# Altium schematic sheet Connector_Sheet.SchDoc
size 420 x 297 mm; SheetNumber: 3; SheetTotal: 3
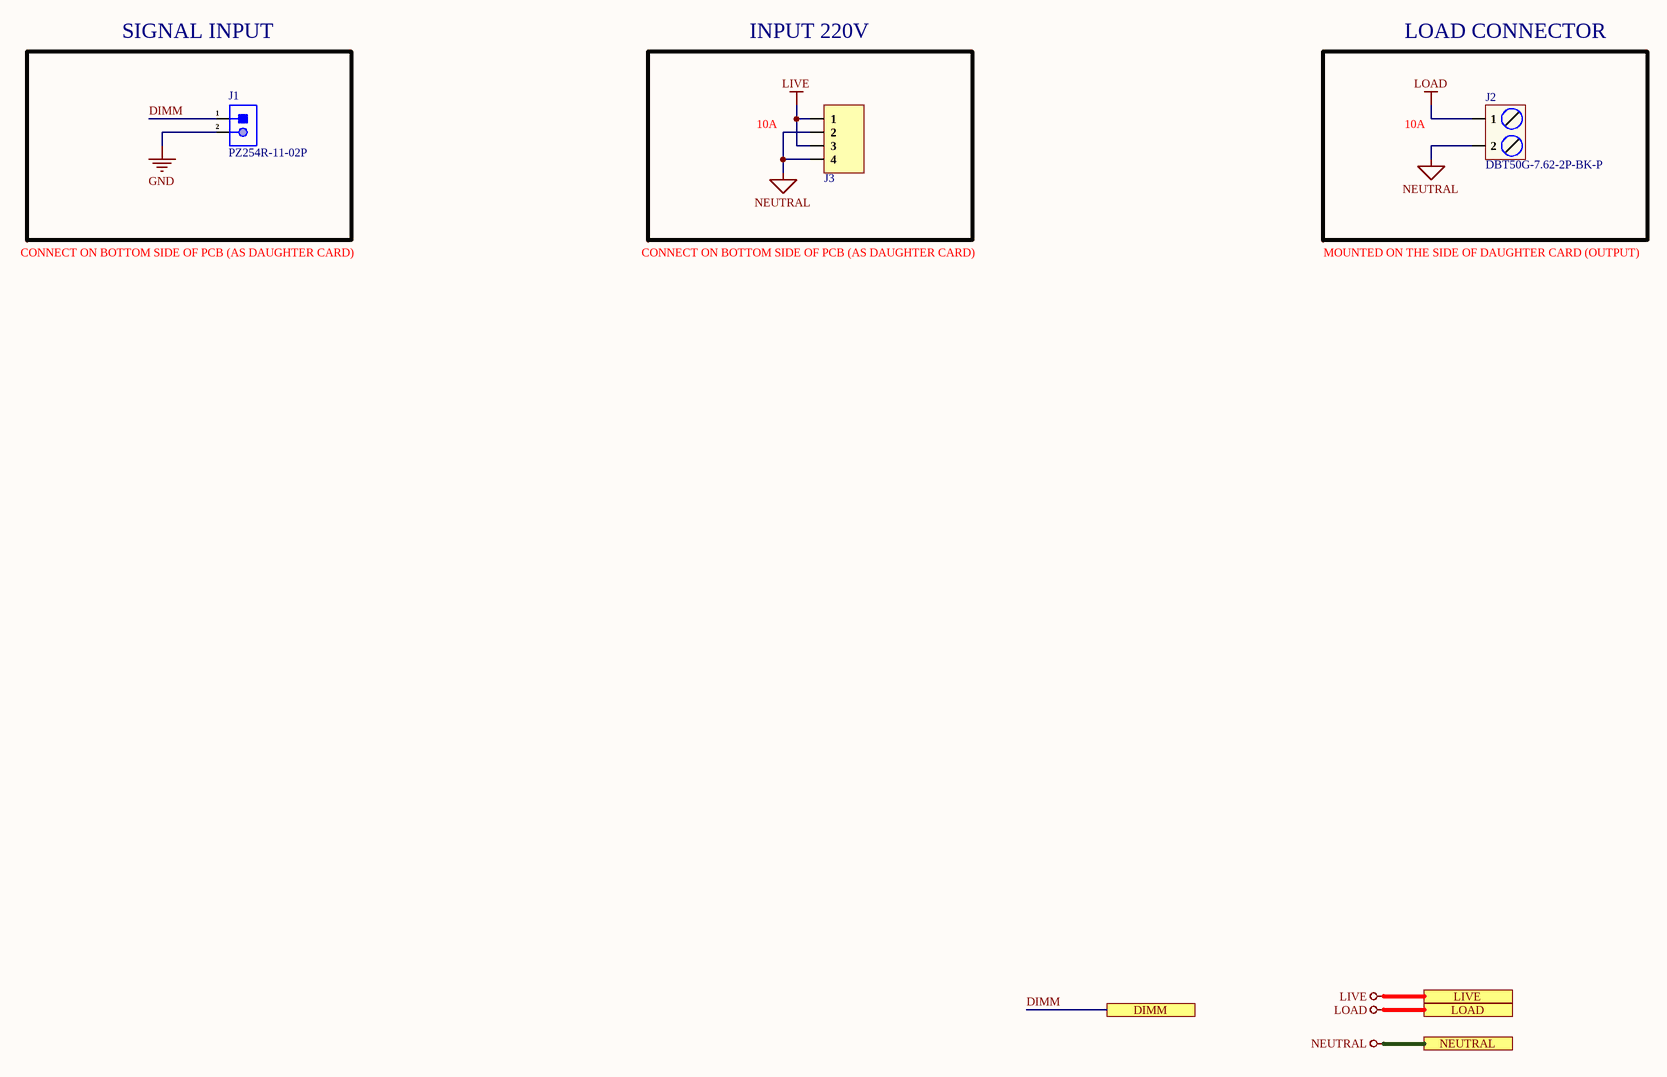
[diagram p0: Connector_Sheet.SchDoc]

## Parts
J1  PZ254R-11-02P  [HDR1X2 (R/A Male)]
J2  DBT50G-7.62-2P-BK-P  [DBT50G-7.62-2P-BK-P]
J3  0444280401  (value not drawn)

## Blocks framed on the sheet
SIGNAL INPUT: J1
INPUT 220V: J3
LOAD CONNECTOR: J2

## Ports
DIMM (see Top_Sheet[3B], Opto_Sheet[4D]), LIVE (see Top_Sheet[2A], Opto_Sheet[5D]), LOAD (see Top_Sheet[3B], Opto_Sheet[5D]), NEUTRAL (see Top_Sheet[2B])

## Nets
GND: J1.2
LIVE: J3.1 J3.3 ; port LIVE
LOAD: J2.1 ; port LOAD
NEUTRAL: J2.2 J3.2 J3.4 ; port NEUTRAL
DIMM: J1.1 ; port DIMM

## Notes on the sheet
- (near J3) 10A
- 10A
- CONNECT ON BOTTOM SIDE OF PCB (AS DAUGHTER CARD)
- MOUNTED ON THE SIDE OF DAUGHTER CARD (OUTPUT)
- File:
- Title:
- Date:
- Page
- Num:
- Total:
- Drawn By: Huzaifa Ali

## Library data of the parts
J1 = PZ254R-11-02P: Right-Angle Square Pins 2.5mm 2P 6mm -40℃~+105℃ 2.54mm Plugin Black Brass 1x2P Push-Pull,P=2.54mm Pin Headers ROHS; Manufacturer: XFCN; Item Type: R/A Male Header; Manufacturer Part Number: PZ254R-11-02P; Package: Push-Pull,P=2.54mm; LCSC Part Number: C492410; ComponentLink1Description: LCSC; ComponentLink1URL: https://www.lcsc.com/product-detail/Pin-Headers_XFCN-PZ254R-11-02P_C492410.html
J2 = DBT50G-7.62-2P-BK-P: 1x2P Corner With Cover Plate 2 1 7.62mm -40℃~+105℃ 20A 300V Black 12~22 Straight Needle Plugin,P=7.62mm Barrier Terminal Blocks ROHS; Manufacturer: DORABO; Manufacturer Part Number: DBT50G-7.62-2P-BK-P; Package: Plugin,P=7.62mm; LCSC Part Number: C496127; Item Type: Terminal Block; ComponentLink1Description: LCSC; ComponentLink1URL: https://www.lcsc.com/product-detail/Barrier-Terminal-Blocks_DORABO-DBT50G-7-62-2P-BK-P_C496127.html
J3 = 0444280401: Connector Header Through Hole, Right Angle 4 position 0.118" (3.00mm); Manufacturer: Molex; Manufacturer Part Number: 0444280401; Digikey Part Number: 23-0444280401-ND; Item Type: Connector; Package: THT; ComponentLink1Description: Digikey; ComponentLink1URL: https://www.digikey.my/en/products/detail/molex/0444280401/513258?s=N4IgTCBcDaIAwBYlgByLgRhAXQL5A